# EAGLE design lcd-interface (EAGLE 5.02)
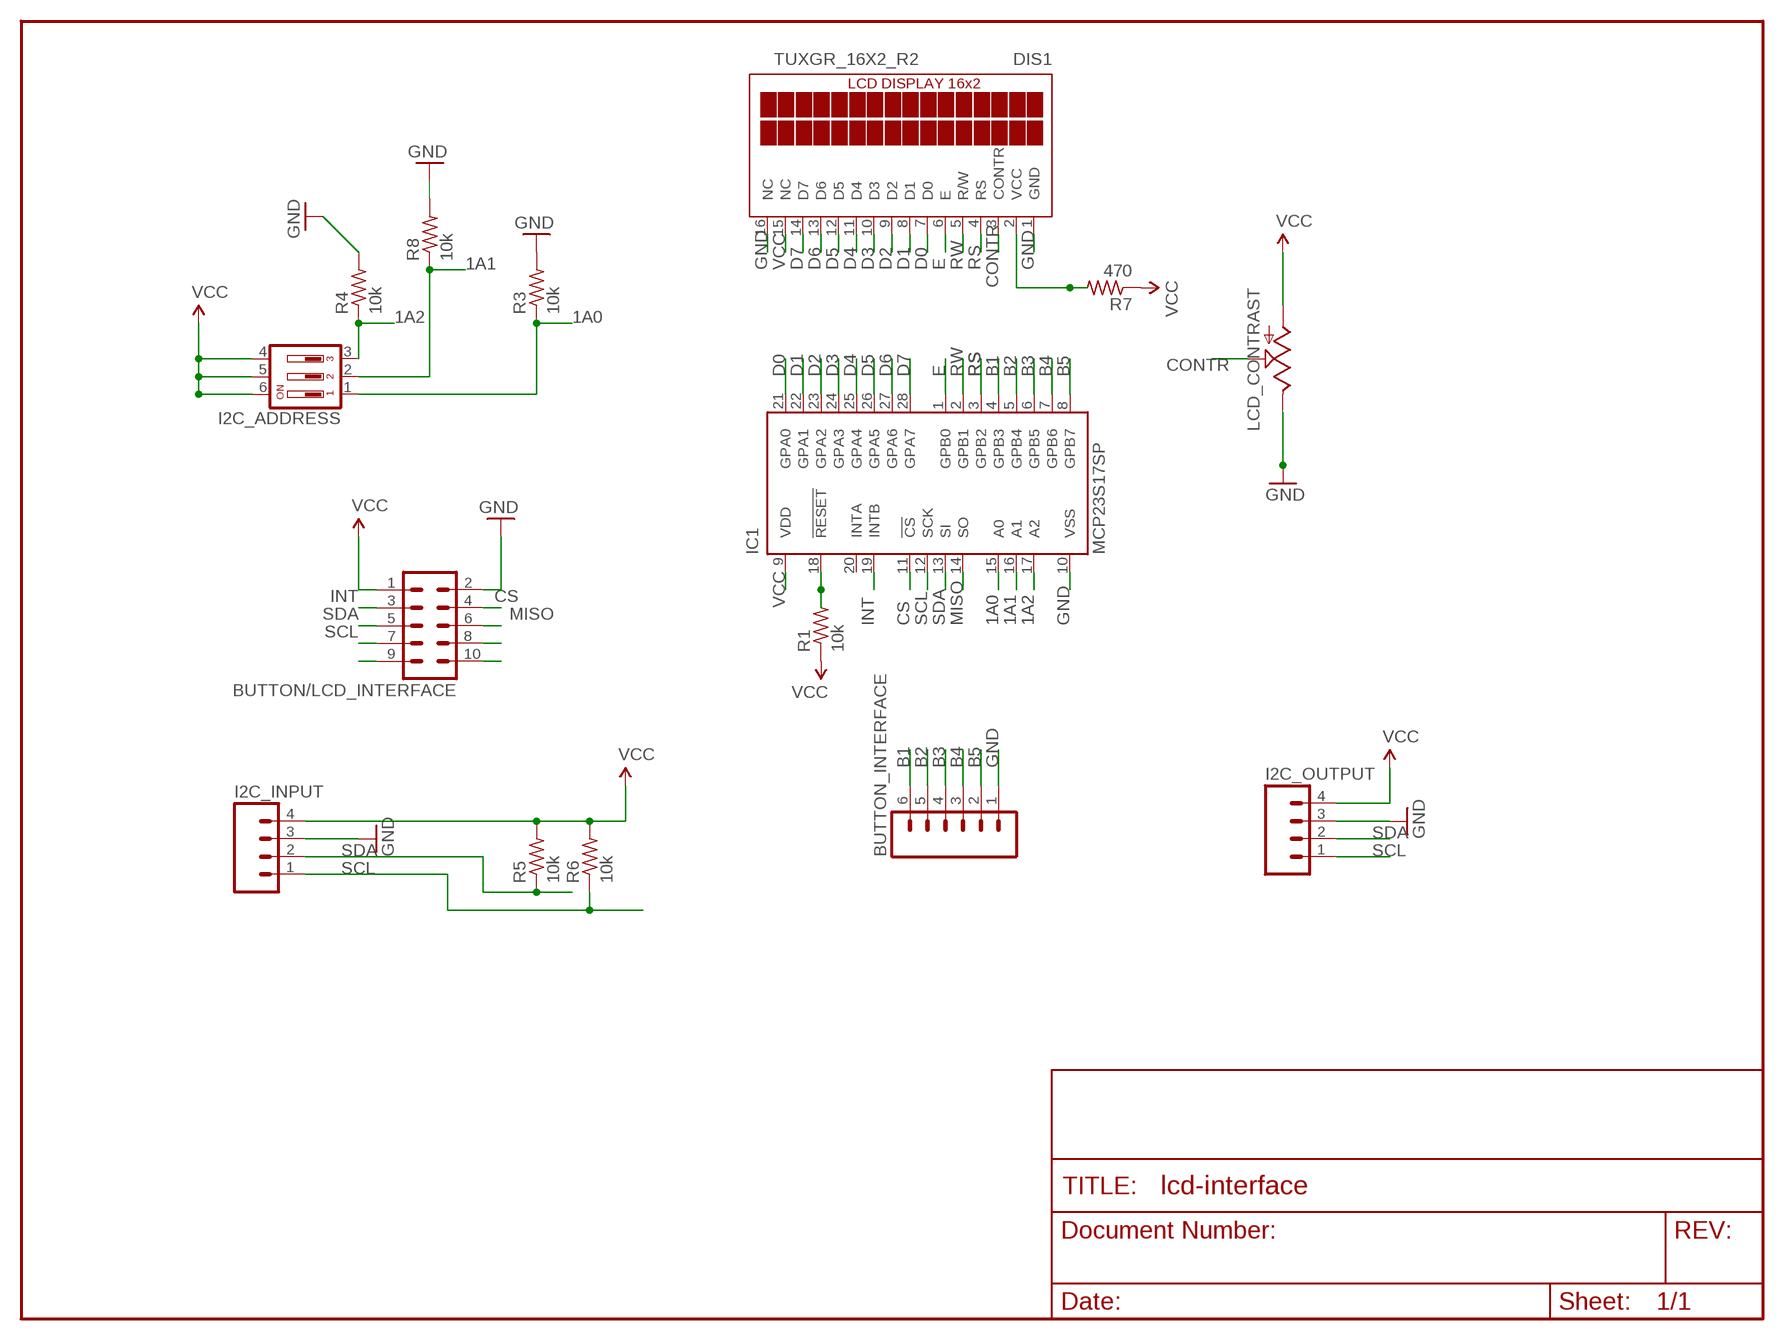
[diagram p0: schematic, sheet 1]

## Parts
BUTTON/LCD_INTERFACE  ML10  [ML10]
BUTTON_INTERFACE  M06SIP  [1X06]
DIS1  TUXGR_16X2_R2  [TUXGR_16X2_R2]
I2C_ADDRESS  DIP03YL  [DIP03YL]
I2C_INPUT  M04PTH  [1X04]
I2C_OUTPUT  M04PTH  [1X04]
IC1  MCP23S17SP  [DIL28-3]
LCD_CONTRAST  POTTRIM  [TRIM_POT]
R1  10k  R-US_0207/10  [0207/10]
R3  10k  R-US_0207/10  [0207/10]
R4  10k  R-US_0207/10  [0207/10]
R5  10k  R-US_0207/10  [0207/10]
R6  10k  R-US_0207/10  [0207/10]
R7  470  R-US_0207/10  [0207/10]
R8  10k  R-US_0207/10  [0207/10]

## Nets
1: BUTTON/LCD_INTERFACE.9
1A0: I2C_ADDRESS.1 IC1.15(A0) R3.1
1A1: I2C_ADDRESS.2 IC1.16(A1) R8.1
1A2: I2C_ADDRESS.3 IC1.17(A2) R4.1
B1: BUTTON_INTERFACE.6 IC1.4(GPB3)
B2: BUTTON_INTERFACE.5 IC1.5(GPB4)
B3: BUTTON_INTERFACE.4 IC1.6(GPB5)
B4: BUTTON_INTERFACE.3 IC1.7(GPB6)
B5: BUTTON_INTERFACE.2 IC1.8(GPB7)
CONTR: DIS1.3(CONTR) LCD_CONTRAST.1(S)
CS: BUTTON/LCD_INTERFACE.4 IC1.11(!CS)
D0: DIS1.7(D0) IC1.21(GPA0)
D1: DIS1.8(D1) IC1.22(GPA1)
D2: DIS1.9(D2) IC1.23(GPA2)
D3: DIS1.10(D3) IC1.24(GPA3)
D4: DIS1.11(D4) IC1.25(GPA4)
D5: DIS1.12(D5) IC1.26(GPA5)
D6: DIS1.13(D6) IC1.27(GPA6)
D7: DIS1.14(D7) IC1.28(GPA7)
E: DIS1.6(E) IC1.1(GPB0)
GND: BUTTON/LCD_INTERFACE.2 BUTTON_INTERFACE.1 DIS1.1(GND) DIS1.16(NC) I2C_INPUT.3 I2C_OUTPUT.3 IC1.10(VSS) LCD_CONTRAST.2(E) R3.2 R4.2 R8.2
INT: BUTTON/LCD_INTERFACE.3 IC1.19(INTB)
LCD+: DIS1.2(VCC) R7.2
MISO: BUTTON/LCD_INTERFACE.6 IC1.14(SO)
N$1: BUTTON/LCD_INTERFACE.8
N$2: BUTTON/LCD_INTERFACE.10
N$10: IC1.18(!RESET) R1.2
RS: DIS1.4(RS) IC1.3(GPB2)
RW: DIS1.5(R/W) IC1.2(GPB1)
SCL: BUTTON/LCD_INTERFACE.7 I2C_INPUT.1 I2C_OUTPUT.1 IC1.12(SCK) R6.1
SDA: BUTTON/LCD_INTERFACE.5 I2C_INPUT.2 I2C_OUTPUT.2 IC1.13(SI) R5.1
VCC: BUTTON/LCD_INTERFACE.1 DIS1.15(NC) I2C_ADDRESS.4 I2C_ADDRESS.5 I2C_ADDRESS.6 I2C_INPUT.4 I2C_OUTPUT.4 IC1.9(VDD) LCD_CONTRAST.3(A) R1.1 R5.2 R6.2 R7.1
Unconnected: IC1.20(INTA)

## Library data of the parts
BUTTON/LCD_INTERFACE = con-harting-ml:ML10: HARTING
BUTTON_INTERFACE = SparkFun:M06: Header 6 Standard 6-pin 0.1" header. Use with straight break away headers (SKU : PRT-00116), right angle break away headers (PRT-00553), swiss pins (PRT-00743), machine pins (PRT-00117), and female headers (PRT-00115). Molex polarized connector foot print use with SKU : PRT-08094 with associated crimp pins and housings.
DIS1 = display-lcd:TUXGR_16X2_R2: Tuxgraphics LCD display 16x2 characters reflective, without background light Source: tuxgr_12x2_r2.pdf
I2C_ADDRESS = switch-dil:DIP03YL: DIL/CODE SWITCH
I2C_INPUT I2C_OUTPUT = SparkFun:M04: Header 4 Standard 4-pin 0.1" header. Use with straight break away headers (SKU : PRT-00116), right angle break away headers (PRT-00553), swiss pins (PRT-00743), machine pins (PRT-00117), and female headers (PRT-00115). Molex polarized connector foot print use with SKU : PRT-08231 with associated crimp pins and housings.
IC1 = microchip:MCP23S17: http://ww1.microchip.com/downloads/en/DeviceDoc/21952a.pdf Source: http://ww1.microchip.com/downloads/en/DeviceDoc/21952a.pdf
LCD_CONTRAST = SparkFun:POT
R1 R3-R8 = resistor:R-US_: RESISTOR, American symbol

## Board
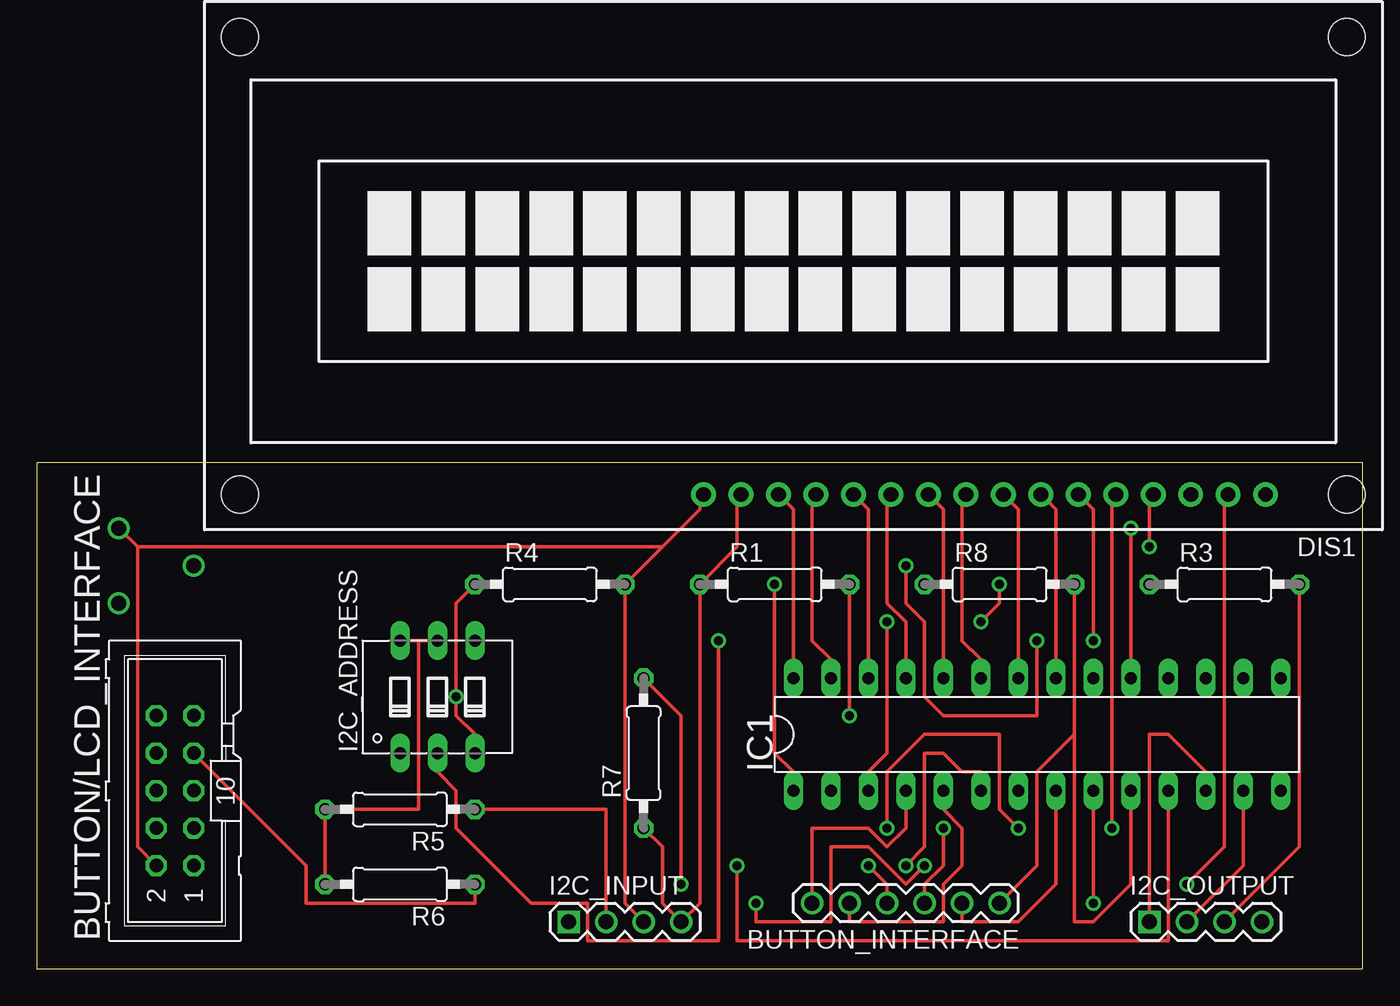
[diagram p1: board, top side]
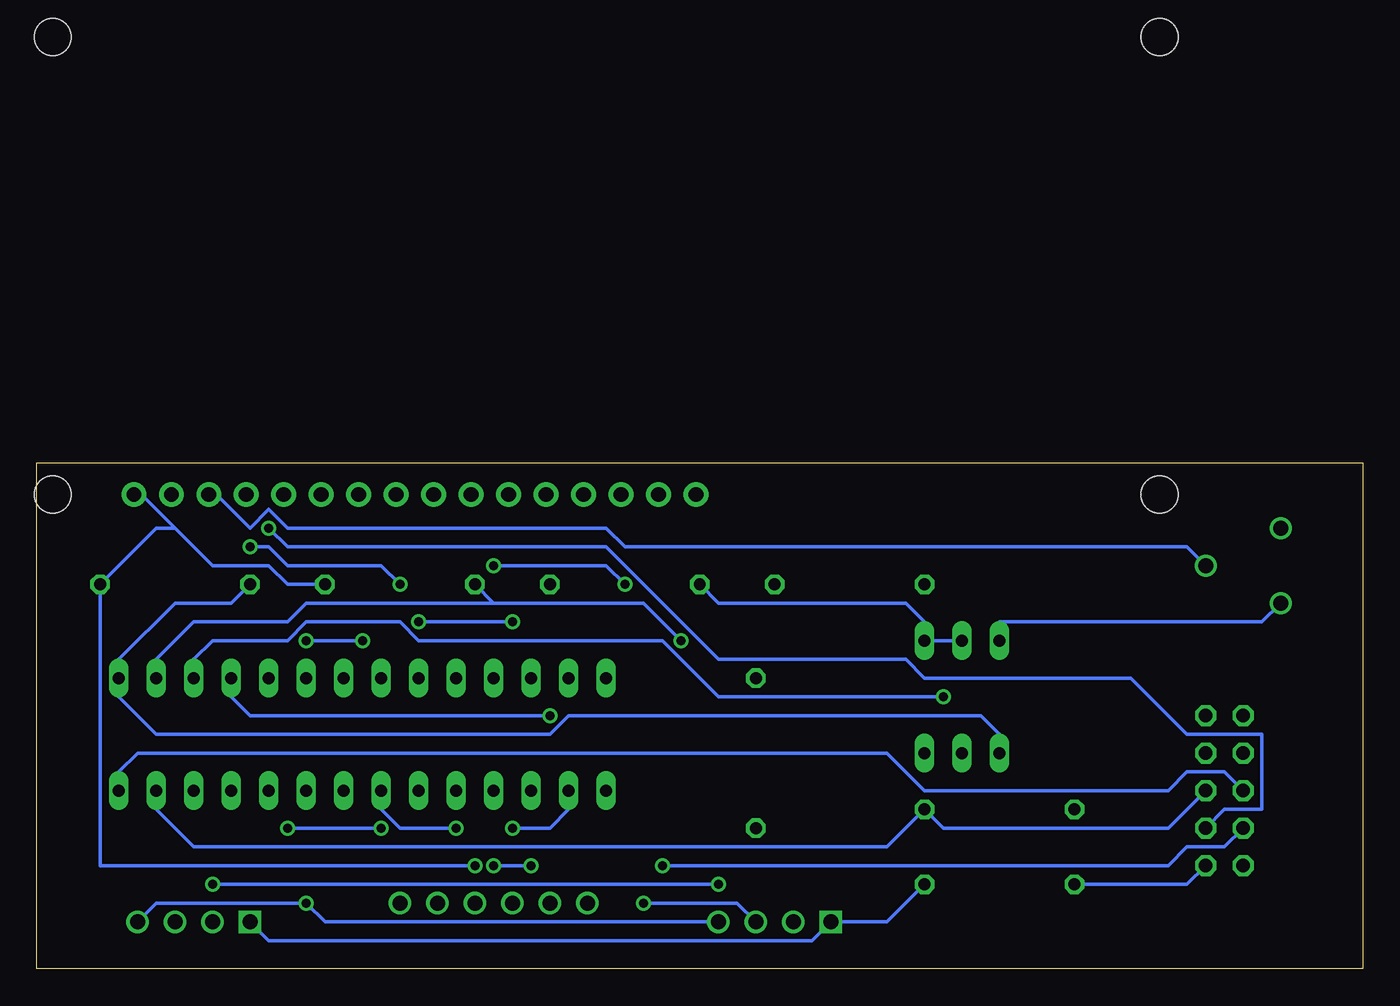
[diagram p2: board, bottom side, seen from below]

Size 89.84 x 34.28 mm. Coordinates in mm from the lower left corner, seen from the top.
Outline: 0,0 89.84,0 89.84,34.28 0,34.28 0,0
Copper layers (1*16): Top 0.035mm / dielectric 1.5mm / Bottom 0.035mm
Design rules "default": minimum track width 10mil, minimum drill 24mil, track to track 8mil, track to pad 8mil, pad to pad 8mil, via to via 8mil, smd to smd 8mil, copper to edge 40mil, drill to drill 8mil, minimum pad ring 10mil, minimum via ring 8mil, stop-mask expansion 4mil, vias tented up to drill 0mil, thermal gap 10mil

### Footprints (pad centres in the part's own frame; a part is rotated, then mirrored left to right if it is on the bottom)
ML10 = drill 0.914 octagon: 1 -5.08,-1.27; 2 -5.08,1.27; 3 -2.54,-1.27; 4 -2.54,1.27; 5 0,-1.27; 6 0,1.27; 7 2.54,-1.27; 8 2.54,1.27; 9 5.08,-1.27; 10 5.08,1.27
1X06 = drill 1.016 round: 1 0,0; 2 2.54,0; 3 5.08,0; 4 7.62,0; 5 10.16,0; 6 12.7,0
TUXGR_16X2_R2 = drill 1 pad 1.676 round: 1 -32,15.5; 2 -29.46,15.5; 3 -26.92,15.5; 4 -24.38,15.5; 5 -21.84,15.5; 6 -19.3,15.5; 7 -16.76,15.5; 8 -14.22,15.5; 9 -11.68,15.5; 10 -9.14,15.5; 11 -6.6,15.5; 12 -4.06,15.5; 13 -1.52,15.5; 14 1.02,15.5; 15 3.56,15.5; 16 6.1,15.5 | hole 2.5: -37.5,-15.5; 37.5,-15.5; -37.5,15.5; 37.5,15.5
DIP03YL = drill 0.813 long: 1 -2.54,-3.81; 2 0,-3.81; 3 2.54,-3.81; 4 2.54,3.81; 5 0,3.81; 6 -2.54,3.81
1X04 = drill 1.016 square: 1 0,0 | drill 1.016 round: 2 2.54,0; 3 5.08,0; 4 7.62,0
DIL28-3 = drill 0.813 long: 1 -16.51,-3.81; 2 -13.97,-3.81; 3 -11.43,-3.81; 4 -8.89,-3.81; 5 -6.35,-3.81; 6 -3.81,-3.81; 7 -1.27,-3.81; 8 1.27,-3.81; 9 3.81,-3.81; 10 6.35,-3.81; 11 8.89,-3.81; 12 11.43,-3.81; 13 13.97,-3.81; 14 16.51,-3.81; 15 16.51,3.81; 16 13.97,3.81; 17 11.43,3.81; 18 8.89,3.81; 19 6.35,3.81; 20 3.81,3.81; 21 1.27,3.81; 22 -1.27,3.81; 23 -3.81,3.81; 24 -6.35,3.81; 25 -8.89,3.81; 26 -11.43,3.81; 27 -13.97,3.81; 28 -16.51,3.81
TRIM_POT = drill 1 round: 1 5.08,0; 2 0,2.54; 3 0,-2.54
0207/10 = drill 0.813 octagon: 1 -5.08,0; 2 5.08,0

### Placement (x,y rotation side)
BUTTON/LCD_INTERFACE  9.36,12.06 90 top
BUTTON_INTERFACE  65.24,4.44 180 top
DIS1  51.27,47.62 180 top
I2C_ADDRESS  27.14,18.41 0 top
I2C_INPUT  36.03,3.17 0 top
I2C_OUTPUT  75.4,3.17 0 top
IC1  67.78,15.87 0 top
LCD_CONTRAST  5.55,27.3 0 top
R1  50,26.03 0 top
R3  80.48,26.03 0 top
R4  34.76,26.03 0 top
R5  24.6,10.79 180 top
R6  24.6,5.71 180 top
R7  41.11,14.6 90 top
R8  65.24,26.03 0 top

### Tracks (layer width: path | path; a pad name or v marks a point on that pad's centre or on a via)
1A0
  Bottom 0.254: I2C_ADDRESS.1 24.6,15.87 25.87,17.14 53.81,17.14 55.08,15.87 81.75,15.87 84.29,18.41 IC1.15 84.29,20.95 80.48,24.76 76.67,24.76 R3.1
1A1  (via drill 0.61)
  Top 0.254: v46.19,22.22 46.19,1.9 37.3,1.9 37.3,4.44 33.49,4.44 28.41,9.52 28.41,12.06 27.14,13.33 I2C_ADDRESS.2
  Bottom 0.254: v46.19,22.22 48.73,24.76 58.89,24.76 | 58.89,24.76 R8.1 | 58.89,24.76 71.59,24.76 72.86,23.49 79.21,23.49 81.75,20.95 IC1.16
1A2  (via drill 0.61)
  Top 0.254: R4.1 28.41,24.76 v28.41,18.41 28.41,17.14 29.68,15.87 I2C_ADDRESS.3
  Bottom 0.254: v28.41,18.41 43.65,18.41 47.46,22.22 63.97,22.22 65.24,23.49 71.59,23.49 72.86,22.22 77.94,22.22 79.21,20.95 IC1.17
B1
  Top 0.254: BUTTON_INTERFACE.6 52.54,9.52 56.35,9.52 57.62,8.25 58.89,9.52 IC1.4
B2
  Top 0.254: BUTTON_INTERFACE.5 55.08,3.17 61.43,3.17 61.43,5.71 62.7,6.98 62.7,9.52 61.43,10.79 IC1.5
B3  (via drill 0.61)
  Top 0.254: v58.89,6.98 60.16,8.25 60.16,14.6 61.43,14.6 62.7,13.33 63.97,13.33 IC1.6 | v56.35,6.98 57.62,5.71 BUTTON_INTERFACE.4
  Bottom 0.254: v56.35,6.98 v58.89,6.98
B4  (via drill 0.61)
  Top 0.254: v61.43,9.52 61.43,6.98 60.16,5.71 BUTTON_INTERFACE.3
  Bottom 0.254: v61.43,9.52 65.24,9.52 66.51,10.79 IC1.7
B5
  Top 0.254: BUTTON_INTERFACE.2 62.7,3.17 66.51,3.17 69.05,5.71 IC1.8
CONTR
  Bottom 0.254: LCD_CONTRAST.1 11.9,28.57 50,28.57 51.27,29.84 72.86,29.84 74.13,31.11 75.4,29.84 77.94,32.38 DIS1.3
CS  (via drill 0.61)
  Top 0.254: v47.46,6.98 47.46,1.9 76.67,1.9 IC1.11
  Bottom 0.254: v47.46,6.98 13.17,6.98 11.9,8.25 9.36,8.25 BUTTON/LCD_INTERFACE.4
D0
  Top 0.254: IC1.21 69.05,31.11 67.78,32.38 DIS1.7
D1
  Top 0.254: IC1.22 66.51,31.11 65.24,32.38 DIS1.8
D2
  Top 0.254: IC1.23 63.97,20.95 62.7,22.22 62.7,32.38 DIS1.9
D3
  Top 0.254: IC1.24 61.43,31.11 60.16,32.38 DIS1.10
D4
  Top 0.254: IC1.25 58.89,23.49 57.62,24.76 57.62,32.38 DIS1.11
D5
  Top 0.254: IC1.26 56.35,31.11 55.08,32.38 DIS1.12
D6
  Top 0.254: IC1.27 53.81,20.95 52.54,22.22 52.54,32.38 DIS1.13
D7
  Top 0.254: IC1.28 51.27,31.11 50,32.38 DIS1.14
E  (via drill 0.61)
  Top 0.254: v50,26.03 50,14.6 51.27,13.33 IC1.1 | v58.89,27.3 58.89,24.76 60.16,23.49 60.16,18.41 61.43,17.14 67.78,17.14 v67.78,22.22 | v71.59,22.22 71.59,31.11 70.32,32.38 DIS1.6
  Bottom 0.254: v50,26.03 51.27,27.3 v58.89,27.3 | v67.78,22.22 v71.59,22.22
GND  (via drill 0.61)
  Top 0.254: R8.2 70.32,15.87 | 70.32,15.87 70.32,3.17 71.59,3.17 74.13,5.71 IC1.10 | BUTTON_INTERFACE.1 67.78,6.98 67.78,13.33 70.32,15.87 | I2C_OUTPUT.3 85.56,8.25 R3.2 | BUTTON/LCD_INTERFACE.2 6.82,8.25 6.82,28.57 | 6.82,28.57 LCD_CONTRAST.2 | 42.38,28.57 44.92,31.11 44.92,32.38 DIS1.16 | 42.38,28.57 R4.2 39.84,4.44 I2C_INPUT.3 | 6.82,28.57 42.38,28.57 | v60.16,6.98 58.89,5.71 56.35,8.25 53.81,8.25 53.81,3.17 48.73,3.17 v48.73,4.44
  Bottom 0.254: R8.2 72.86,26.03 74.13,27.3 77.94,27.3 80.48,29.84 | 80.48,29.84 83.02,32.38 DIS1.1 | 80.48,29.84 81.75,29.84 R3.2 85.56,6.98 v60.16,6.98 | v48.73,4.44 42.38,4.44 I2C_INPUT.3
INT  (via drill 0.61)
  Top 0.254: v74.13,29.84 IC1.19
  Bottom 0.254: v74.13,29.84 72.86,28.57 51.27,28.57 43.65,20.95 30.95,20.95 29.68,19.68 15.71,19.68 11.9,15.87 6.82,15.87 6.82,10.79 9.36,10.79 BUTTON/LCD_INTERFACE.3
LCD+  (via drill 0.61)
  Top 0.254: R7.2 43.65,17.14 v43.65,5.71 | v77.94,5.71 80.48,8.25 80.48,32.38 DIS1.2
  Bottom 0.254: v43.65,5.71 v77.94,5.71
MISO
  Bottom 0.254: BUTTON/LCD_INTERFACE.6 9.36,13.33 11.9,13.33 13.17,12.06 29.68,12.06 32.22,14.6 83.02,14.6 84.29,13.33 IC1.14
N$10  (via drill 0.61)
  Top 0.254: v55.08,17.14 R1.2
  Bottom 0.254: v55.08,17.14 75.4,17.14 76.67,18.41 IC1.18
RS  (via drill 0.61)
  Top 0.254: v57.62,23.49 57.62,14.6 56.35,13.33 IC1.3 | v63.97,23.49 65.24,24.76 v65.24,26.03 | v75.4,28.57 75.4,32.38 DIS1.4
  Bottom 0.254: v57.62,23.49 v63.97,23.49 | v65.24,26.03 66.51,27.3 72.86,27.3 74.13,28.57 v75.4,28.57
RW  (via drill 0.61)
  Top 0.254: v57.62,9.52 57.62,13.33 60.16,15.87 65.24,15.87 65.24,10.79 v66.51,9.52 | v72.86,9.52 72.86,32.38 DIS1.5
  Bottom 0.254: v57.62,9.52 55.08,9.52 53.81,10.79 IC1.2 | v66.51,9.52 v72.86,9.52
SCL
  Top 0.254: I2C_OUTPUT.1 75.4,15.87 76.67,15.87 79.21,13.33 IC1.12 | BUTTON/LCD_INTERFACE.7 18.25,6.98 18.25,4.44 29.68,4.44 R6.1
  Bottom 0.254: R6.1 32.22,3.17 I2C_INPUT.1 37.3,1.9 74.13,1.9 I2C_OUTPUT.1
SDA
  Top 0.254: I2C_OUTPUT.2 81.75,6.98 IC1.13 | R5.1 38.57,10.79 I2C_INPUT.2
  Bottom 0.254: BUTTON/LCD_INTERFACE.5 13.17,9.52 28.41,9.52 R5.1 32.22,8.25 79.21,8.25 81.75,10.79 IC1.13
VCC  (via drill 0.61)
  Top 0.254: R6.2 R5.2 25.87,10.79 25.87,22.22 | 25.87,22.22 I2C_ADDRESS.5 | 25.87,22.22 I2C_ADDRESS.6 | v71.59,4.44 IC1.9 | R7.1 42.38,8.25 42.38,4.44 I2C_INPUT.4 44.92,4.44 R1.1 47.46,28.57 47.46,32.38 DIS1.15
  Bottom 0.254: BUTTON/LCD_INTERFACE.1 11.9,5.71 R6.2 | I2C_ADDRESS.5 I2C_ADDRESS.4 29.68,23.49 30.95,24.76 43.65,24.76 R1.1 | LCD_CONTRAST.3 6.82,23.49 24.6,23.49 I2C_ADDRESS.6 | I2C_OUTPUT.4 81.75,4.44 v71.59,4.44 70.32,3.17 I2C_INPUT.4